# EAGLE schematic micromouse6.3 (EAGLE 7.5.0)
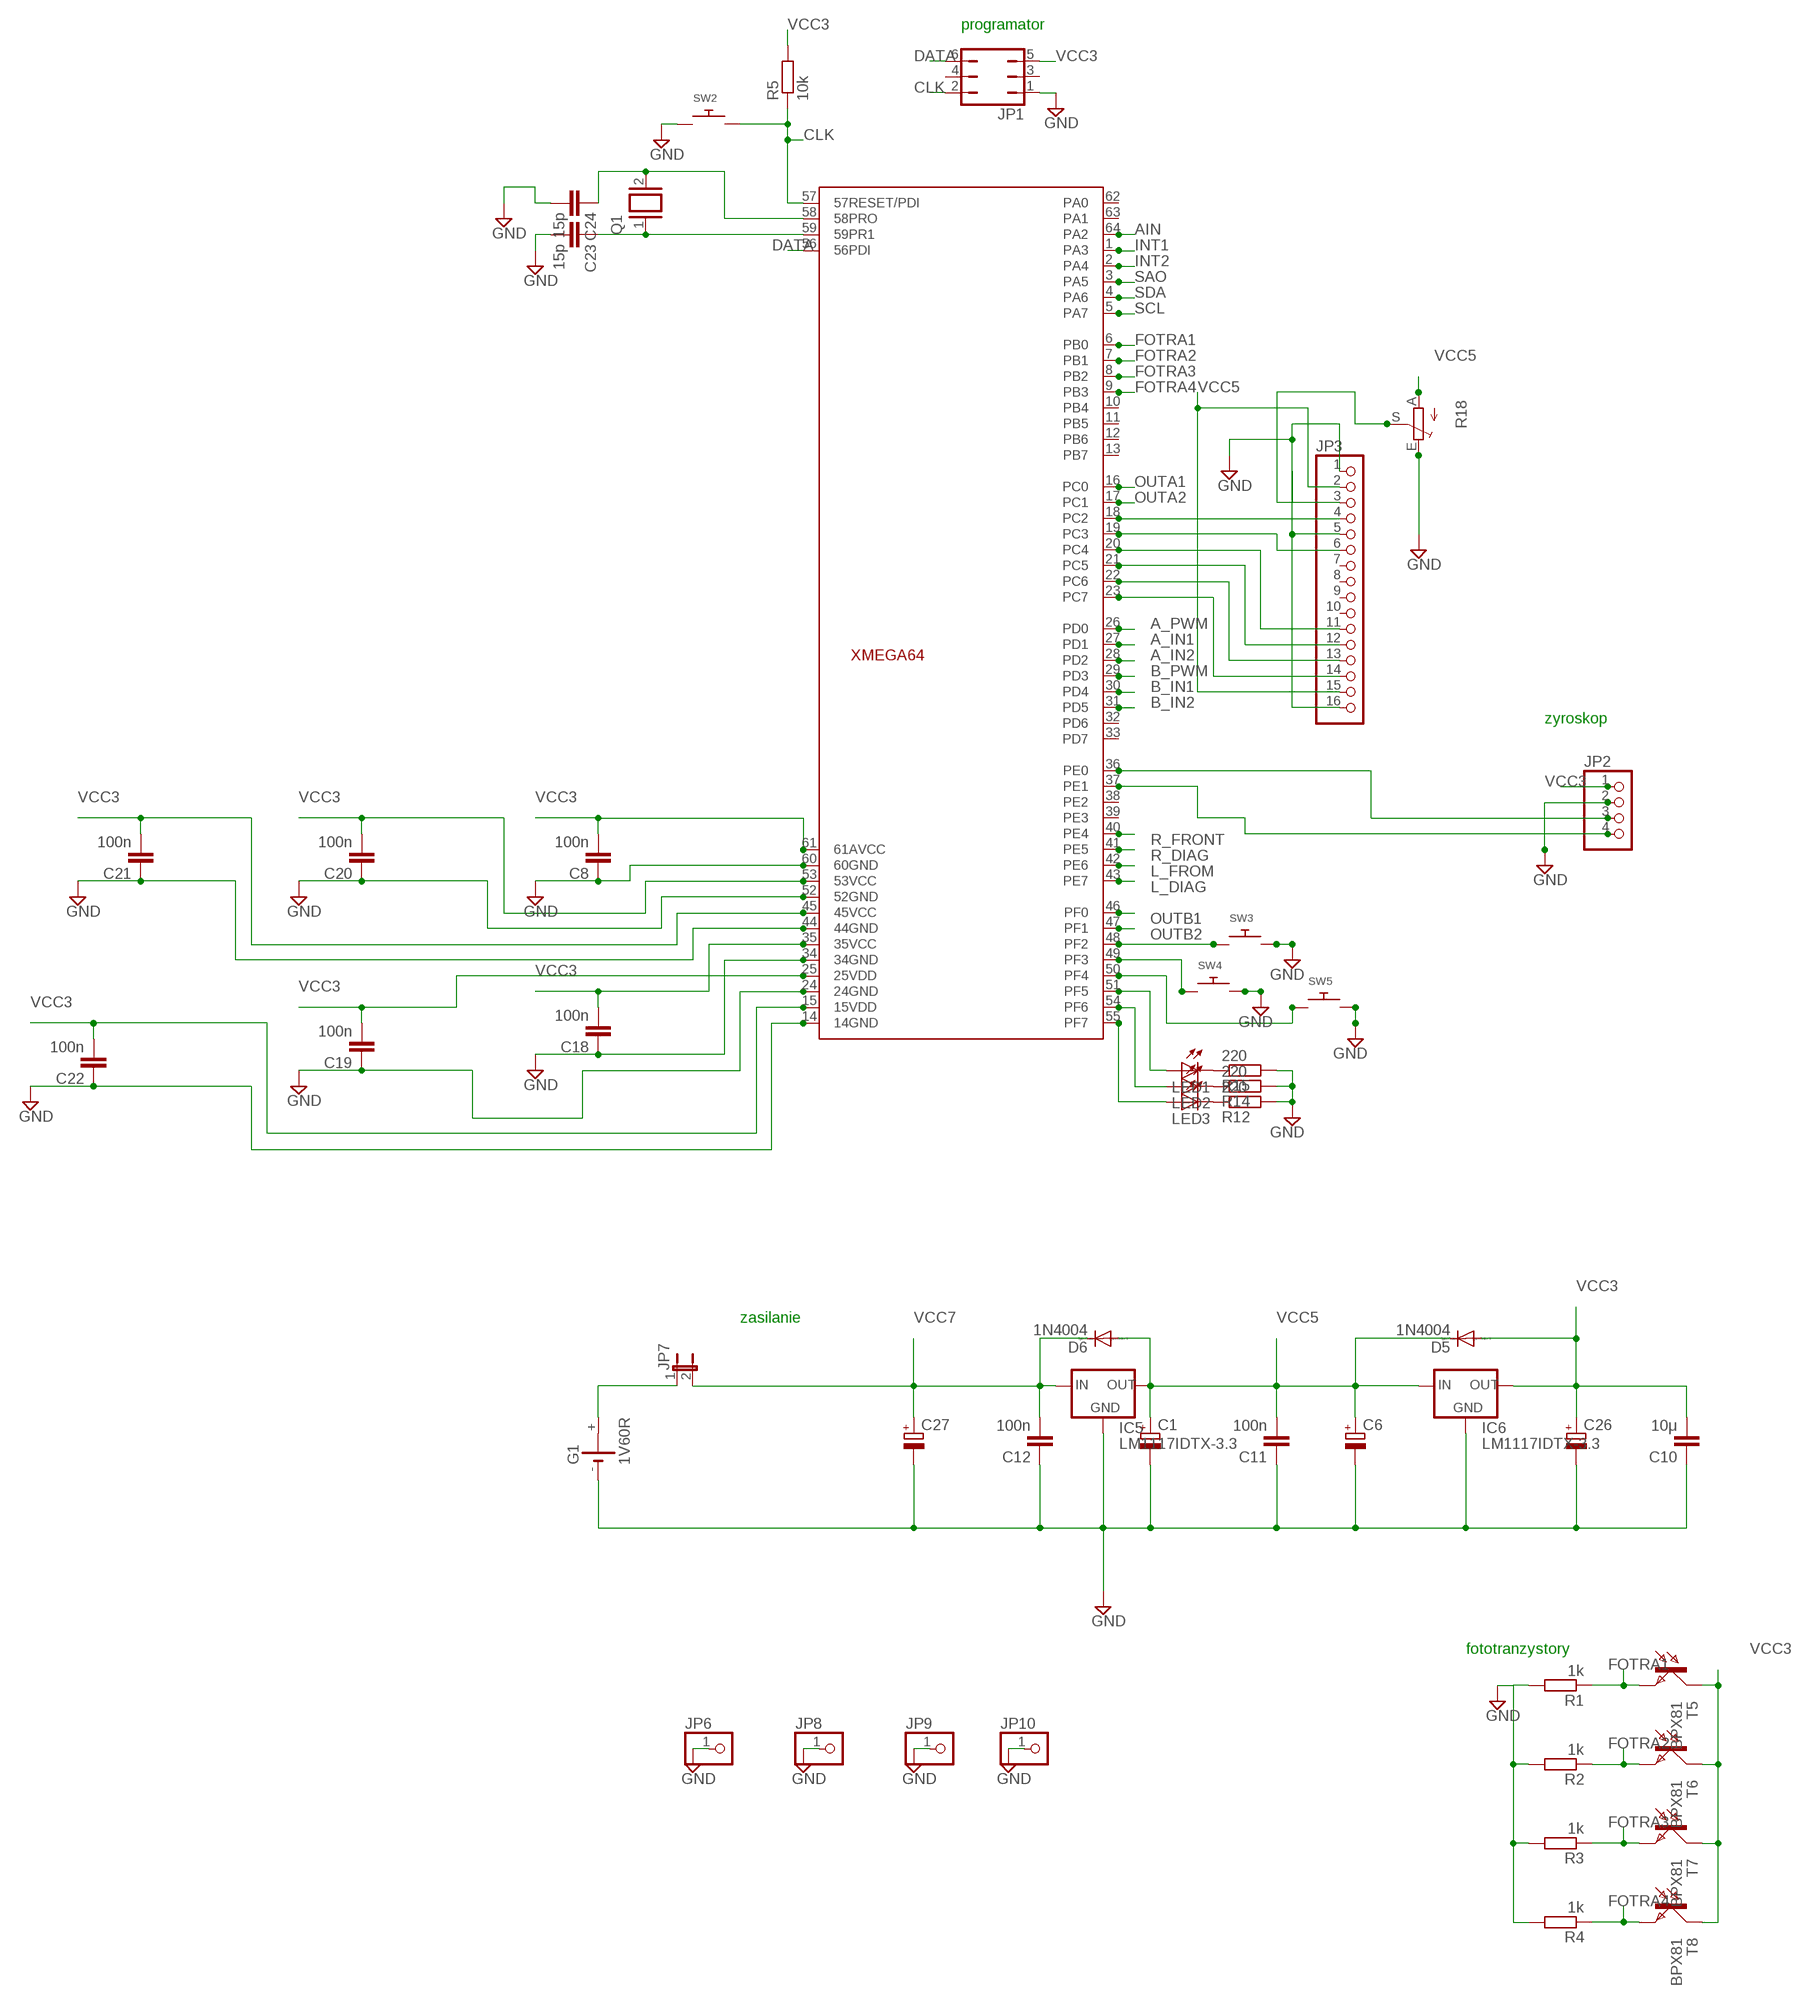
[diagram p0: schematic, sheet 1, part 1 of 2]
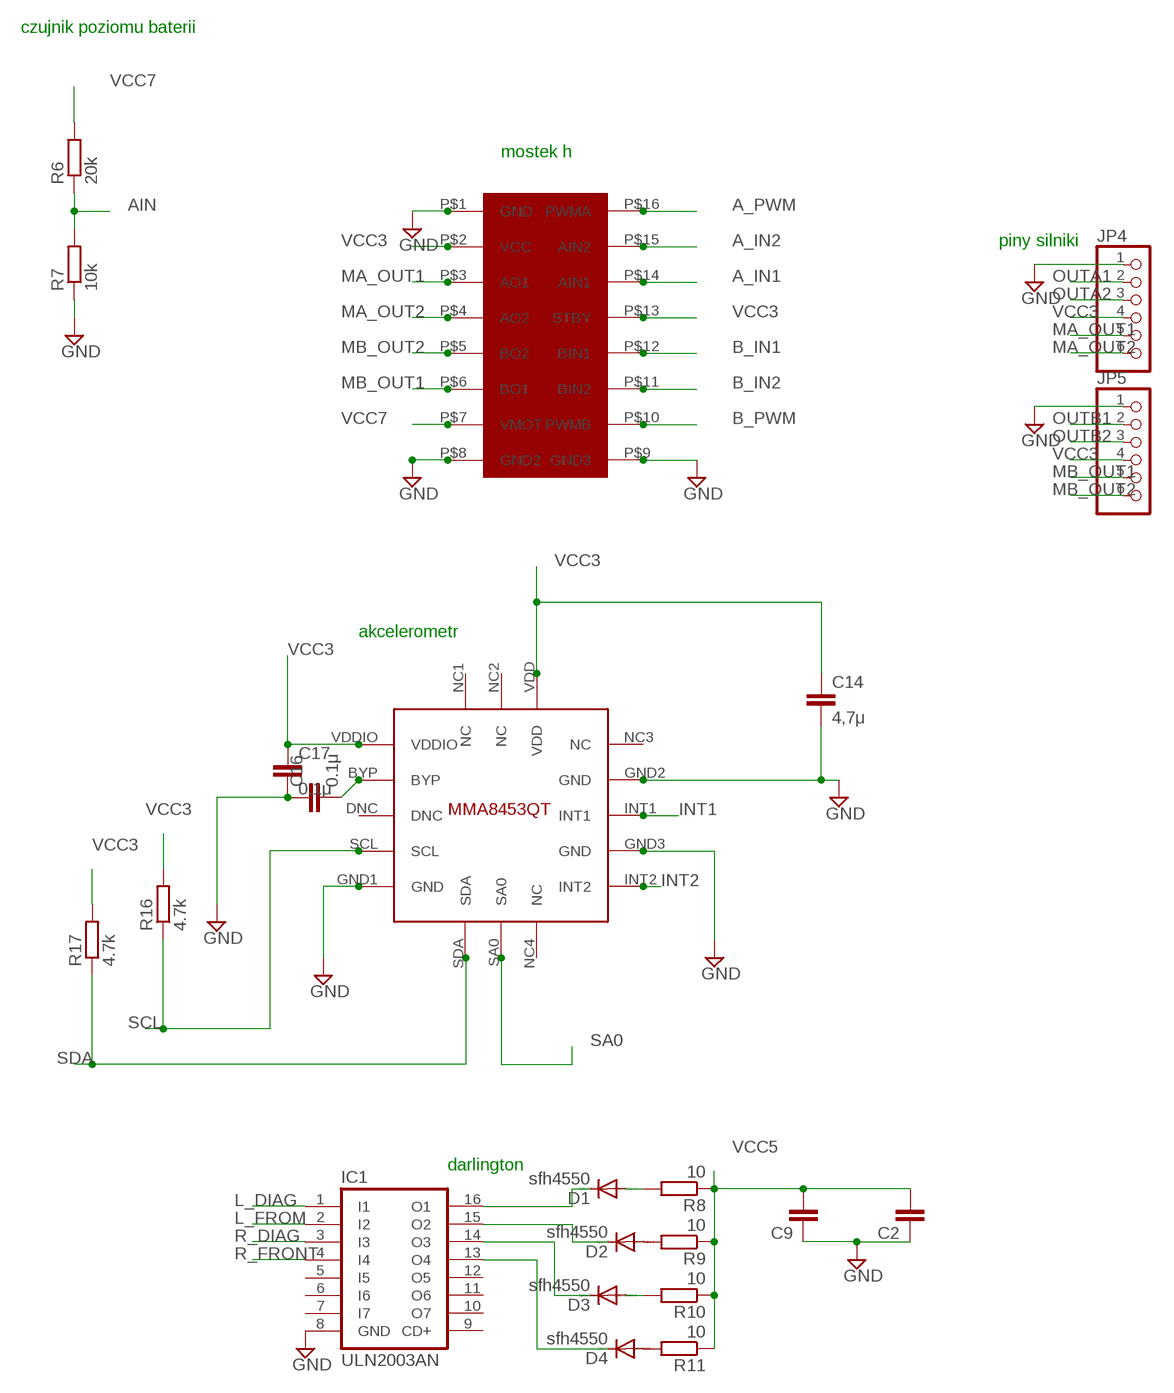
[diagram p1: schematic, sheet 1, part 2 of 2]

## Parts
ACC1  MMA8453QT  [MMA8453QT]
C1  CPOL-EUE2.5-5  [E2,5-5]
C2  C-EU025-024X044  [C025-024X044]
C6  CPOL-EUE2.5-5  [E2,5-5]
C8  100n  C-EU025-024X044  [C025-024X044]
C9  C-EU025-024X044  [C025-024X044]
C10  10μ  C-EU025-024X044  [C025-024X044]
C11  100n  C-EU025-024X044  [C025-024X044]
C12  100n  C-EU025-024X044  [C025-024X044]
C14  4,7μ  C-EU025-024X044  [C025-024X044]
C16  0.1μ  C-EU025-024X044  [C025-024X044]
C17  0.1μ  C-EU025-024X044  [C025-024X044]
C18  100n  C-EU025-024X044  [C025-024X044]
C19  100n  C-EU025-024X044  [C025-024X044]
C20  100n  C-EU025-024X044  [C025-024X044]
C21  100n  C-EU025-024X044  [C025-024X044]
C22  100n  C-EU025-024X044  [C025-024X044]
C23  15p  C-EU025-024X044  [C025-024X044]
C24  15p  C-EU025-024X044  [C025-024X044]
C26  CPOL-EUE2.5-5  [E2,5-5]
C27  CPOL-EUE2.5-5  [E2,5-5]
D1  sfh4550  1N4004  [DO41-10]
D2  sfh4550  1N4004  [DO41-10]
D3  sfh4550  1N4004  [DO41-10]
D4  sfh4550  1N4004  [DO41-10]
D5  1N4004  [DO41-10]
D6  1N4004  [DO41-10]
G1  1V60R  [1V60R]
IC1  ULN2003AN  [DIL16]
IC5  LM1117IDTX-3.3  [TO252]
IC6  LM1117IDTX-3.3  [TO252]
JP1  JP3Q  [JP3Q]
JP2  PINHD-1X4  [1X04]
JP3  PINHD-1X16  [1X16]
JP4  PINHD-1X6  [1X06]
JP5  PINHD-1X6  [1X06]
JP6  PINHD-1X1  [1X01]
JP7  JP1E  [JP1]
JP8  PINHD-1X1  [1X01]
JP9  PINHD-1X1  [1X01]
JP10  PINHD-1X1  [1X01]
LED1  LEDSMT1206  [1206]
LED2  LEDSMT1206  [1206]
LED3  LEDSMT1206  [1206]
Q1  XTAL/S  [QS]
R1  1k  R-EU_R0805  [R0805]
R2  1k  R-EU_R0805  [R0805]
R3  1k  R-EU_R0805  [R0805]
R4  1k  R-EU_R0805  [R0805]
R5  10k  R-EU_R0805  [R0805]
R6  20k  R-EU_R0805  [R0805]
R7  10k  R-EU_R0805  [R0805]
R8  10  R-EU_R0805  [R0805]
R9  10  R-EU_R0805  [R0805]
R10  10  R-EU_R0805  [R0805]
R11  10  R-EU_R0805  [R0805]
R12  220  R-EU_R0805  [R0805]
R14  220  R-EU_R0805  [R0805]
R15  220  R-EU_R0805  [R0805]
R16  4.7k  R-EU_R0805  [R0805]
R17  4.7k  R-EU_R0805  [R0805]
R18  TRIM_EU-B25P  [B25P]
SW2  SWITCH_PUSHBUTTONEVQ-PE  [TACT_PANA-EVQ]
SW3  SWITCH_PUSHBUTTONEVQ-PE  [TACT_PANA-EVQ]
SW4  SWITCH_PUSHBUTTONEVQ-PE  [TACT_PANA-EVQ]
SW5  SWITCH_PUSHBUTTONEVQ-PE  [TACT_PANA-EVQ]
T5  BPX81  [BPX81]
T6  BPX81  [BPX81]
T7  BPX81  [BPX81]
T8  BPX81  [BPX81]
U$1  POLULU713  [POLULU713]
XMEGA64  XMEGA64C3TQFP64  [TQFP64]

## Nets
A_IN1: U$1.P$14(AIN1) XMEGA64.27(PD1)
A_IN2: U$1.P$15(AIN2) XMEGA64.28(PD2)
A_PWM: U$1.P$16(PWMA) XMEGA64.26(PD0)
AIN: R6.1 R7.2 XMEGA64.64(PA2)
B_IN1: U$1.P$12(BIN1) XMEGA64.30(PD4)
B_IN2: U$1.P$11(BIN2) XMEGA64.31(PD5)
B_PWM: U$1.P$10(PWMB) XMEGA64.29(PD3)
CLK: JP1.2 R5.1 SW2.P$2 XMEGA64.57(57RESET/PDI)
CLK_: JP2.3 XMEGA64.36(PE0)
DATA: JP1.6 XMEGA64.56(56PDI)
FOTRA1: R1.1 T5.E XMEGA64.6(PB0)
FOTRA2: R2.1 T6.E XMEGA64.7(PB1)
FOTRA3: R3.1 T7.E XMEGA64.8(PB2)
FOTRA4: R4.1 T8.E XMEGA64.9(PB3)
GND: ACC1.GND1(GND) ACC1.GND2(GND) ACC1.GND3(GND) C1.- C2.1 C6.- C8.1 C9.1 C10.1 C11.1 C12.1 C14.2 C16.1 C17.2 C18.1 C19.1 C20.1 C21.1 C22.1 C23.2 C24.2 C26.- C27.- G1.- IC1.8(GND) IC5.1(GND) IC6.1(GND) JP1.1 JP2.2 JP3.1 JP3.5 JP3.16 JP4.1 JP5.1 JP6.1 JP8.1 JP9.1 JP10.1 R1.2 R2.2 R3.2 R4.2 R7.1 R12.2 R14.2 R15.2 R18.E SW2.P$1 SW3.P$2 SW4.P$2 SW5.P$2 U$1.P$1(GND) U$1.P$8(GND2) U$1.P$9(GND3) XMEGA64.14(14GND) XMEGA64.24(24GND) XMEGA64.34(34GND) XMEGA64.44(44GND) XMEGA64.52(52GND) XMEGA64.60(60GND)
INT1: ACC1.INT1 XMEGA64.1(PA3)
INT2: ACC1.INT2 XMEGA64.2(PA4)
L_DIAG: IC1.1(I1) XMEGA64.43(PE7)
L_FROM: IC1.2(I2) XMEGA64.42(PE6)
MA_OUT1: JP4.5 U$1.P$3(AO1)
MA_OUT2: JP4.6 U$1.P$4(AO2)
MB_OUT1: JP5.5 U$1.P$6(BO1)
MB_OUT2: JP5.6 U$1.P$5(BO2)
N$1: LED1.A XMEGA64.51(PF5)
N$2: D2.A R9.2
N$3: D1.A R8.2
N$4: D1.C IC1.16(O1)
N$5: D2.C IC1.15(O2)
N$6: D4.A R11.2
N$7: D3.C IC1.14(O3)
N$8: D3.A R10.2
N$9: D4.C IC1.13(O4)
N$10: LED2.A XMEGA64.54(PF6)
N$12: JP3.13 XMEGA64.22(PC6)
N$13: JP3.4 XMEGA64.18(PC2)
N$14: JP3.6 XMEGA64.19(PC3)
N$15: LED3.A XMEGA64.55(PF7)
N$16: C23.1 Q1.1 XMEGA64.59(59PR1)
N$17: SW3.P$1 XMEGA64.48(PF2)
N$18: G1.+ JP7.1
N$19: JP3.3 R18.S
N$20: C24.1 Q1.2 XMEGA64.58(58PRO)
N$21: SW4.P$1 XMEGA64.49(PF3)
N$22: SW5.P$1 XMEGA64.50(PF4)
N$23: JP3.11 XMEGA64.20(PC4)
N$24: LED3.C R12.1
N$25: LED2.C R14.1
N$26: LED1.C R15.1
N$27: JP2.4 XMEGA64.37(PE1)
N$30: ACC1.BYP C16.2
N$32: JP3.12 XMEGA64.21(PC5)
N$34: JP3.14 XMEGA64.23(PC7)
OUTA1: JP4.2 XMEGA64.16(PC0)
OUTA2: JP4.3 XMEGA64.17(PC1)
OUTB1: JP5.2 XMEGA64.46(PF0)
OUTB2: JP5.3 XMEGA64.47(PF1)
R_DIAG: IC1.3(I3) XMEGA64.41(PE5)
R_FRONT: IC1.4(I4) XMEGA64.40(PE4)
SA0: ACC1.SA0
SAO: XMEGA64.3(PA5)
SCL: ACC1.SCL R16.1 XMEGA64.5(PA7)
SDA: ACC1.SDA R17.1 XMEGA64.4(PA6)
VCC3: ACC1.VDD ACC1.VDDIO C8.2 C10.2 C14.1 C17.1 C18.2 C19.2 C20.2 C21.2 C22.2 C26.+ D5.A IC6.TAB(OUT) JP1.5 JP2.1 JP4.4 JP5.4 R5.2 R16.2 R17.2 T5.C T6.C T7.C T8.C U$1.P$2(VCC) U$1.P$13(STBY) XMEGA64.15(15VDD) XMEGA64.25(25VDD) XMEGA64.35(35VCC) XMEGA64.45(45VCC) XMEGA64.53(53VCC) XMEGA64.61(61AVCC)
VCC5: C1.+ C2.2 C6.+ C9.2 C11.2 D5.C D6.A IC5.TAB(OUT) IC6.2(IN) JP3.2 JP3.15 R8.1 R9.1 R10.1 R11.1 R18.A
VCC7: C12.2 C27.+ D6.C IC5.2(IN) JP7.2 R6.2 U$1.P$7(VMOT)
Unconnected: ACC1.DNC ACC1.NC1(NC) ACC1.NC2(NC) ACC1.NC3(NC) ACC1.NC4(NC) G1.+@1(+) IC1.5(I5) IC1.6(I6) IC1.7(I7) IC1.9(CD+) IC1.10(O7) IC1.11(O6) IC1.12(O5) JP1.3 JP1.4 JP3.7 JP3.8 JP3.9 JP3.10 XMEGA64.10(PB4) XMEGA64.11(PB5) XMEGA64.12(PB6) XMEGA64.13(PB7) XMEGA64.32(PD6) XMEGA64.33(PD7) XMEGA64.38(PE2) XMEGA64.39(PE3) XMEGA64.62(PA0) XMEGA64.63(PA1)

## Notes on the sheet
- programator
- czujnik poziomu baterii
- zyroskop
- mostek h
- piny silniki
- akcelerometr
- zasilanie
- fototranzystory
- darlington

## Library data of the parts
ACC1 = MMA8453QT:MMA8453QT
C1 C6 C26 C27 = rcl:CPOL-EU: POLARIZED CAPACITOR, European symbol
C2 C8-C12 C14 C16-C24 = rcl:C-EU: CAPACITOR, European symbol
D1-D6 = diode:1N4004: DIODE general purpose rectifier, 1 A
G1 = battery:1V60R: NC ACCU Varta
IC1 = uln-udn:ULN2003A: DRIVER ARRAY
IC5 IC6 = lm1117:LM1117IDTX-*
JP1 = jumper:JP3Q: JUMPER
JP2 = pinhead:PINHD-1X4: PIN HEADER
JP3 = pinhead:PINHD-1X16: PIN HEADER
JP4 JP5 = pinhead:PINHD-1X6: PIN HEADER
JP6 JP8-JP10 = pinhead:PINHD-1X1: PIN HEADER
JP7 = jumper:JP1E: JUMPER
LED1-LED3 = led:LED: LED OSRAM: - CHIPLED LG R971, LG N971, LY N971, LG Q971, LY Q971, LO R971, LY R971 LH N974, LH R974 LS Q976, LO Q976, LY Q976 LO Q996 - Hyper CHIPLED LW Q18S LB Q993, LB Q99A, LB R99A - SideLED LS A670, LO A670, LY A670, LG A670, LP A670 LB A673, LV A673, LT A673, LW A673 LH A674 LY A675 LS A676, LA A676, LO A676, LY A676, LW A676 LS A679, LY A679, LG A679 - Hyper Micro SIDELED® LS Y876, LA Y876, LO Y876, LY Y876 LT Y87S - SmartLED LW L88C, LW L88S LB L89C, LB L89S, LG L890 LS L89K, LO L89K, LY L89K LS L896, LA L896, LO L896, LY L896 - TOPLED LS T670, LO T670, LY T670, LG T670, LP T670 LSG T670, LSP T670, LSY T670, LOP T670, LYG T670 LG T671, LOG T671, LSG T671 LB T673, LV T673, LT T673, LW T673 LH T674 LS T676, LA T676, LO T676, LY T676, LB T676, LH T676, LSB T676, LW T676 LB T67C, LV T67C, LT T67C, LS T67K, LO T67K, LY T67K, LW E67C LS E67B, LA E67B, LO E67B, LY E67B, LB E67C, LV E67C, LT E67C LW T67C LS T679, LY T679, LG T679 LS T770, LO T770, LY T770, LG T770, LP T770 LB T773, LV T773, LT T773, LW T773 LH T774 LS E675, LA E675, LY E675, LS T675 LS T776, LA T776, LO T776, LY T776, LB T776 LHGB T686 LT T68C, LB T68C - Hyper Mini TOPLED® LB M676 - Mini TOPLED Santana® LG M470 LS M47K, LO M47K, LY M47K Source: http://www.osram.convergy.de LUXEON: - LUMILED® LXK2-PW12-R00, LXK2-PW12-S00, LXK2-PW14-U00, LXK2-PW14-V00 LXK2-PM12-R00, LXK2-PM12-S00, LXK2-PM14-U00 LXK2-PE12-Q00, LXK2-PE12-R00, LXK2-PE12-S00, LXK2-PE14-T00, LXK2-PE14-U00 LXK2-PB12-K00, LXK2-PB12-L00, LXK2-PB12-M00, LXK2-PB14-N00, LXK2-PB14-P00, LXK2-PB14-Q00 LXK2-PR12-L00, LXK2-PR12-M00, LXK2-PR14-Q00, LXK2-PR14-R00 LXK2-PD12-Q00, LXK2-PD12-R00, LXK2-PD12-S00 LXK2-PH12-R00, LXK2-PH12-S00 LXK2-PL12-P00, LXK2-PL12-Q00, LXK2-PL12-R00 Source: www.luxeon.com KINGBRIGHT: KA-3528ASYC Source: www.kingbright.com
Q1 = special:XTAL/S: CRYSTAL
R1-R12 R14-R17 = rcl:R-EU_: RESISTOR, European symbol
R18 = pot:TRIM_EU-: POTENTIOMETER
SW2-SW5 = adafruit:SWITCH_PUSHBUTTON: Buttons SOFTTOUCHSMD_SJ - Soft touch temporary push button (Super Junk Akihabara) Compatible with SKPMANE010 [Mouser: 688-SKPMAN] C&K_KSS = Digikey: KSS221GLFS
T5-T8 = opto-trans-siemens:BPX81: PHOTO TRANSISTOR; OC_FARNELL: unknown; OC_NEWARK: unknown
U$1 = polulu:POLULU713
XMEGA64 = atmega-atxmega:XMEGA64C3: High-performance, low-power Atmel® AVR® XMEGA® 8/16-bit Microcontroller  Nonvolatile program and data memories  64K - 256KBytes of In-System Self-Programmable Flash  4K - 8KBytes Boot Code Section with Independent Lock Bits  2K - 4KBytes EEPROM  4K - 16KBytes Internal SRAM  Peripheral features  Four-channel event system  Five 16-bit timer/counters  Four timer/counters with four output compare or input capture channels  One timer/counter with two output compare or input capture channels  High resolution extension on two timer/counters  Advanced waveform extension (AWeX) on one timer/counter  One USB device interface  USB 2.0 full speed (12Mbps) and low speed (1.5Mbps) device compliant  32 Endpoints with full configuration flexibility  Three USARTs with IrDA support for one USART  Two two-wire interfaces with dual address match (I2C and SMBus compatible)  Two serial peripheral interfaces (SPIs)  CRC-16 (CRC-CCITT) and CRC-32 (IEEE®802.3) generator  16-bit real time counter (RTC) with separate oscillator  One sixteen-channel, 12-bit, 300ksps Analog to Digital Converter  Two Analog Comparators with window compare function, and current sources  External interrupts on all general purpose I/O pins  Programmable watchdog timer with separate on-chip ultra low power oscillator  QTouch® library support  Capacitive touch buttons, sliders and wheels  Special microcontroller features  Power-on reset and programmable brown-out detection  Internal and external clock options with PLL and prescaler  Programmable multilevel interrupt controller  Five sleep modes  Programming and debug interface  PDI (program and debug interface)  I/O and packages  50 programmable I/O pins  64-lead TQFP  64-pad QFN  Operating voltage  1.6 – 3.6V  Operating frequency  0 – 12MHz from 1.6V  0 – 32MHz from 2.7V